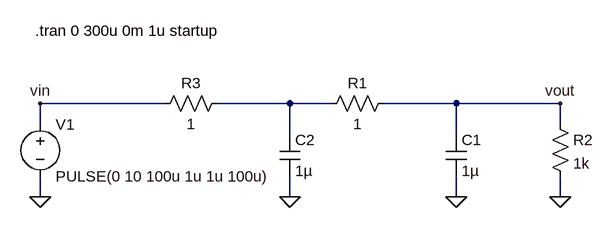
[diagram p0: schematic RC_filter.asc]
RC_filter.asc, the LTspice schematic file:
Version 4.1
SHEET 1 1752 2500
WIRE 656 1008 464 1008
WIRE 848 1008 736 1008
WIRE 912 1008 848 1008
WIRE 1104 1008 992 1008
WIRE 1264 1008 1104 1008
WIRE 464 1040 464 1008
WIRE 1264 1040 1264 1008
WIRE 848 1056 848 1008
WIRE 1104 1056 1104 1008
WIRE 464 1152 464 1120
WIRE 848 1152 848 1120
WIRE 1104 1152 1104 1120
WIRE 1264 1152 1264 1120
FLAG 464 1152 0
FLAG 1104 1152 0
FLAG 1264 1152 0
FLAG 464 1008 vin
FLAG 1264 1008 vout
FLAG 848 1152 0
SYMBOL voltage 464 1024 R0
WINDOW 123 0 0 Left 0
WINDOW 39 0 0 Left 0
SYMATTR InstName V1
SYMATTR Value PULSE(0 10 100u 1u 1u 100u)
SYMBOL res 1008 992 R90
WINDOW 0 0 56 VBottom 2
WINDOW 3 32 56 VTop 2
SYMATTR InstName R1
SYMATTR Value 1
SYMBOL cap 1088 1056 R0
SYMATTR InstName C1
SYMATTR Value 1µ
SYMBOL res 1248 1024 R0
SYMATTR InstName R2
SYMATTR Value 1k
SYMBOL res 752 992 R90
WINDOW 0 0 56 VBottom 2
WINDOW 3 32 56 VTop 2
SYMATTR InstName R3
SYMATTR Value 1
SYMBOL cap 832 1056 R0
SYMATTR InstName C2
SYMATTR Value 1µ
TEXT 456 896 Left 2 !.tran 0 300u 0m 1u startup

The netlist it stands for:
* RC_filter.asc
V1 vin 0 PULSE(0 10 100u 1u 1u 100u)
R1 vout N001 1
C1 vout 0 1µ
R2 vout 0 1k
R3 N001 vin 1
C2 N001 0 1µ
.tran 0 300u 0m 1u startup
.backanno
.end